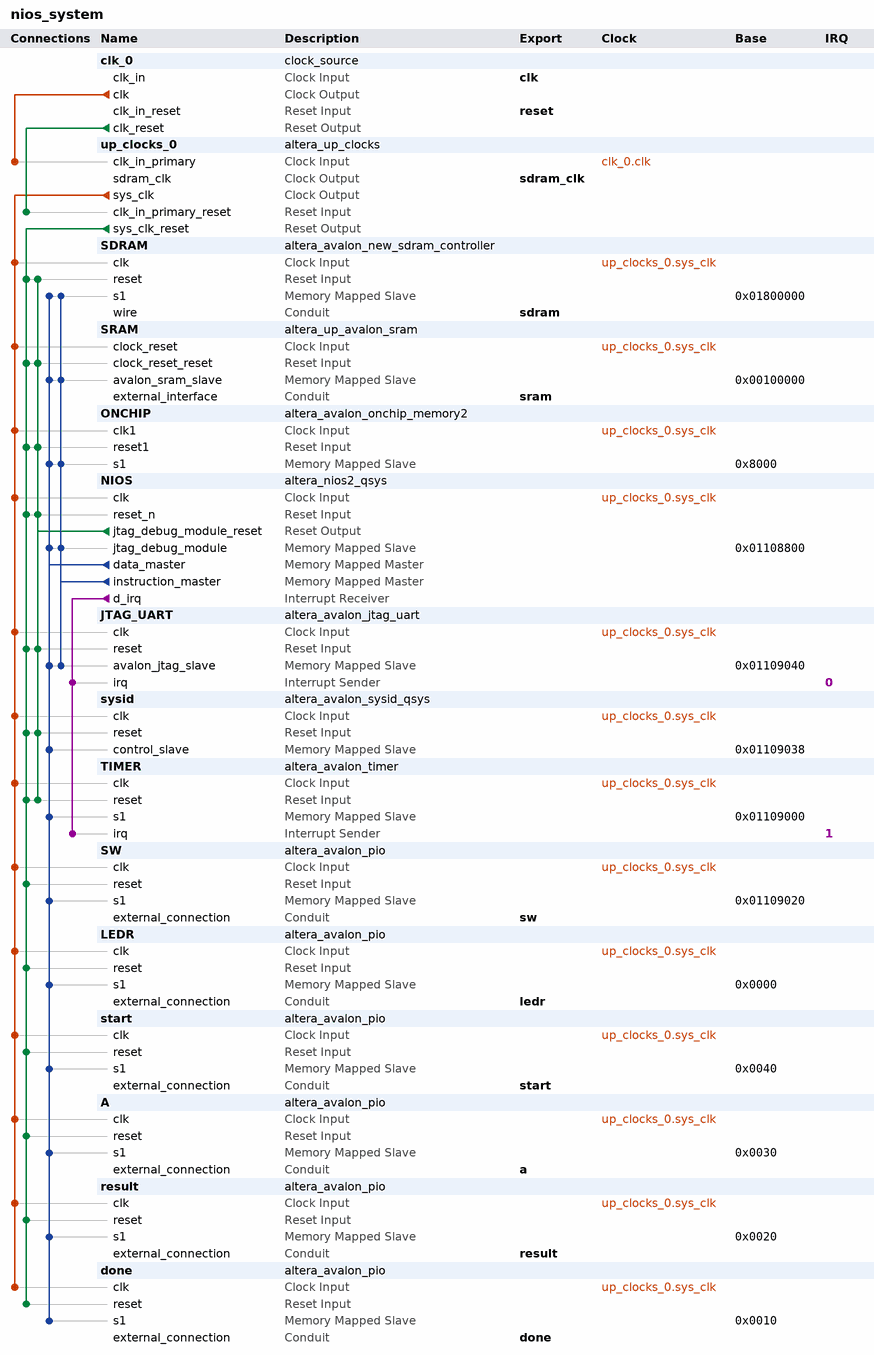
[diagram p0: system contents]
# Platform Designer (Qsys) system nios_system, Cyclone II EP2C20F484C7
# Parameters at their usual value, and those the tool derives, are not listed.
package require -exact qsys 13.0.1.99.2
create_system nios_system
set_project_property DEVICE_FAMILY {Cyclone II}
set_project_property DEVICE EP2C20F484C7

add_instance clk_0 clock_source 13.0
set_instance_parameter_value clk_0 clockFrequency 50000000

add_instance up_clocks_0 altera_up_clocks 13.0
set_instance_parameter_value up_clocks_0 board DE1
set_instance_parameter_value up_clocks_0 vga_clk false
set_instance_parameter_value up_clocks_0 audio_clk false
set_instance_parameter_value up_clocks_0 audio_clk_freq 12.288

add_instance SDRAM altera_avalon_new_sdram_controller 13.0.1.99.2
set_instance_parameter_value SDRAM TAC 5.5
set_instance_parameter_value SDRAM TRCD 20.0
set_instance_parameter_value SDRAM TRP 20.0
set_instance_parameter_value SDRAM casLatency 3
set_instance_parameter_value SDRAM columnWidth 8
set_instance_parameter_value SDRAM dataWidth 16
set_instance_parameter_value SDRAM generateSimulationModel false
set_instance_parameter_value SDRAM model single_Micron_MT48LC4M32B2_7_chip
set_instance_parameter_value SDRAM numberOfBanks 4
set_instance_parameter_value SDRAM numberOfChipSelects 1
set_instance_parameter_value SDRAM powerUpDelay 100.0
set_instance_parameter_value SDRAM refreshPeriod 15.625
set_instance_parameter_value SDRAM rowWidth 12

add_instance SRAM altera_up_avalon_sram 13.0
set_instance_parameter_value SRAM board DE1
set_instance_parameter_value SRAM pixel_buffer false

add_instance ONCHIP altera_avalon_onchip_memory2 13.0.1.99.2
set_instance_parameter_value ONCHIP dataWidth 32
set_instance_parameter_value ONCHIP dualPort false
set_instance_parameter_value ONCHIP initMemContent true
set_instance_parameter_value ONCHIP initializationFileName onchip_mem.hex
set_instance_parameter_value ONCHIP memorySize 16384

add_instance NIOS altera_nios2_qsys 13.0
set_instance_parameter_value NIOS resetSlave SDRAM.s1
set_instance_parameter_value NIOS mmu_TLBMissExcSlave None
set_instance_parameter_value NIOS exceptionSlave SDRAM.s1
set_instance_parameter_value NIOS breakSlave NIOS.jtag_debug_module
set_instance_parameter_value NIOS impl Fast
set_instance_parameter_value NIOS icache_size 512
set_instance_parameter_value NIOS dcache_size 512

add_instance JTAG_UART altera_avalon_jtag_uart 13.0.1.99.2
set_instance_parameter_value JTAG_UART simInteractiveOptions NO_INTERACTIVE_WINDOWS

add_instance sysid altera_avalon_sysid_qsys 13.0
set_instance_parameter_value sysid id 0

add_instance TIMER altera_avalon_timer 13.0.1.99.2
set_instance_parameter_value TIMER period 10
set_instance_parameter_value TIMER periodUnits SEC

add_instance SW altera_avalon_pio 13.0.1.99.2
set_instance_parameter_value SW direction Input
set_instance_parameter_value SW width 10

add_instance LEDR altera_avalon_pio 13.0.1.99.2
set_instance_parameter_value LEDR direction Output
set_instance_parameter_value LEDR width 10

add_instance start altera_avalon_pio 13.0.1.99.2
set_instance_parameter_value start direction Output
set_instance_parameter_value start width 1

add_instance A altera_avalon_pio 13.0.1.99.2
set_instance_parameter_value A direction Output
set_instance_parameter_value A width 32

add_instance result altera_avalon_pio 13.0.1.99.2
set_instance_parameter_value result direction Input
set_instance_parameter_value result width 16

add_instance done altera_avalon_pio 13.0.1.99.2
set_instance_parameter_value done direction Input
set_instance_parameter_value done width 1

# connections
add_connection clk_0.clk up_clocks_0.clk_in_primary clock
add_connection up_clocks_0.sys_clk A.clk clock
add_connection up_clocks_0.sys_clk done.clk clock
add_connection up_clocks_0.sys_clk JTAG_UART.clk clock
add_connection up_clocks_0.sys_clk LEDR.clk clock
add_connection up_clocks_0.sys_clk NIOS.clk clock
add_connection up_clocks_0.sys_clk ONCHIP.clk1 clock
add_connection up_clocks_0.sys_clk result.clk clock
add_connection up_clocks_0.sys_clk SDRAM.clk clock
add_connection up_clocks_0.sys_clk SRAM.clock_reset clock
add_connection up_clocks_0.sys_clk start.clk clock
add_connection up_clocks_0.sys_clk SW.clk clock
add_connection up_clocks_0.sys_clk sysid.clk clock
add_connection up_clocks_0.sys_clk TIMER.clk clock
add_connection clk_0.clk_reset up_clocks_0.clk_in_primary_reset reset
add_connection NIOS.jtag_debug_module_reset JTAG_UART.reset reset
add_connection NIOS.jtag_debug_module_reset NIOS.reset_n reset
add_connection NIOS.jtag_debug_module_reset ONCHIP.reset1 reset
add_connection NIOS.jtag_debug_module_reset SDRAM.reset reset
add_connection NIOS.jtag_debug_module_reset SRAM.clock_reset_reset reset
add_connection NIOS.jtag_debug_module_reset sysid.reset reset
add_connection NIOS.jtag_debug_module_reset TIMER.reset reset
add_connection up_clocks_0.sys_clk_reset A.reset reset
add_connection up_clocks_0.sys_clk_reset done.reset reset
add_connection up_clocks_0.sys_clk_reset JTAG_UART.reset reset
add_connection up_clocks_0.sys_clk_reset LEDR.reset reset
add_connection up_clocks_0.sys_clk_reset NIOS.reset_n reset
add_connection up_clocks_0.sys_clk_reset ONCHIP.reset1 reset
add_connection up_clocks_0.sys_clk_reset result.reset reset
add_connection up_clocks_0.sys_clk_reset SDRAM.reset reset
add_connection up_clocks_0.sys_clk_reset SRAM.clock_reset_reset reset
add_connection up_clocks_0.sys_clk_reset start.reset reset
add_connection up_clocks_0.sys_clk_reset SW.reset reset
add_connection up_clocks_0.sys_clk_reset sysid.reset reset
add_connection up_clocks_0.sys_clk_reset TIMER.reset reset
add_connection NIOS.data_master A.s1 avalon
set_connection_parameter_value NIOS.data_master/A.s1 baseAddress 0x0030
add_connection NIOS.data_master done.s1 avalon
set_connection_parameter_value NIOS.data_master/done.s1 baseAddress 0x0010
add_connection NIOS.data_master JTAG_UART.avalon_jtag_slave avalon
set_connection_parameter_value NIOS.data_master/JTAG_UART.avalon_jtag_slave baseAddress 0x01109040
add_connection NIOS.data_master LEDR.s1 avalon
set_connection_parameter_value NIOS.data_master/LEDR.s1 baseAddress 0x0000
add_connection NIOS.data_master NIOS.jtag_debug_module avalon
set_connection_parameter_value NIOS.data_master/NIOS.jtag_debug_module baseAddress 0x01108800
add_connection NIOS.data_master ONCHIP.s1 avalon
set_connection_parameter_value NIOS.data_master/ONCHIP.s1 baseAddress 0x8000
add_connection NIOS.data_master result.s1 avalon
set_connection_parameter_value NIOS.data_master/result.s1 baseAddress 0x0020
add_connection NIOS.data_master SDRAM.s1 avalon
set_connection_parameter_value NIOS.data_master/SDRAM.s1 baseAddress 0x01800000
add_connection NIOS.data_master SRAM.avalon_sram_slave avalon
set_connection_parameter_value NIOS.data_master/SRAM.avalon_sram_slave baseAddress 0x00100000
add_connection NIOS.data_master start.s1 avalon
set_connection_parameter_value NIOS.data_master/start.s1 baseAddress 0x0040
add_connection NIOS.data_master SW.s1 avalon
set_connection_parameter_value NIOS.data_master/SW.s1 baseAddress 0x01109020
add_connection NIOS.data_master sysid.control_slave avalon
set_connection_parameter_value NIOS.data_master/sysid.control_slave baseAddress 0x01109038
add_connection NIOS.data_master TIMER.s1 avalon
set_connection_parameter_value NIOS.data_master/TIMER.s1 baseAddress 0x01109000
add_connection NIOS.instruction_master JTAG_UART.avalon_jtag_slave avalon
set_connection_parameter_value NIOS.instruction_master/JTAG_UART.avalon_jtag_slave baseAddress 0x01109040
add_connection NIOS.instruction_master NIOS.jtag_debug_module avalon
set_connection_parameter_value NIOS.instruction_master/NIOS.jtag_debug_module baseAddress 0x01108800
add_connection NIOS.instruction_master ONCHIP.s1 avalon
set_connection_parameter_value NIOS.instruction_master/ONCHIP.s1 baseAddress 0x8000
add_connection NIOS.instruction_master SDRAM.s1 avalon
set_connection_parameter_value NIOS.instruction_master/SDRAM.s1 baseAddress 0x01800000
add_connection NIOS.instruction_master SRAM.avalon_sram_slave avalon
set_connection_parameter_value NIOS.instruction_master/SRAM.avalon_sram_slave baseAddress 0x00100000
add_connection NIOS.d_irq JTAG_UART.irq interrupt
set_connection_parameter_value NIOS.d_irq/JTAG_UART.irq irqNumber 0
add_connection NIOS.d_irq TIMER.irq interrupt
set_connection_parameter_value NIOS.d_irq/TIMER.irq irqNumber 1

# exported interfaces
add_interface clk clock sink
set_interface_property clk EXPORT_OF clk_0.clk_in
add_interface reset reset sink
set_interface_property reset EXPORT_OF clk_0.clk_in_reset
add_interface sdram_clk clock source
set_interface_property sdram_clk EXPORT_OF up_clocks_0.sdram_clk
add_interface sdram conduit end
set_interface_property sdram EXPORT_OF SDRAM.wire
add_interface sram conduit end
set_interface_property sram EXPORT_OF SRAM.external_interface
add_interface sw conduit end
set_interface_property sw EXPORT_OF SW.external_connection
add_interface ledr conduit end
set_interface_property ledr EXPORT_OF LEDR.external_connection
add_interface start conduit end
set_interface_property start EXPORT_OF start.external_connection
add_interface a conduit end
set_interface_property a EXPORT_OF A.external_connection
add_interface result conduit end
set_interface_property result EXPORT_OF result.external_connection
add_interface done conduit end
set_interface_property done EXPORT_OF done.external_connection

set_interconnect_requirement {$system} qsys_mm.clockCrossingAdapter HANDSHAKE
set_interconnect_requirement {$system} qsys_mm.maxAdditionalLatency 1

save_system nios_system.qsys
